# Altium schematic sheet vaSmd-V3.SchDoc
size A4; PageSetup: Record=PageOptions|CenterHorizontal=True|CenterVertical=True|PrintScale=1.00|XCorrection=1.00|YCorrection=1.00|PrintKind=1|BorderSize=5000000|LeftOffset=0|BottomOffset=0|Orientation=2|PaperLength=1000|PaperWidth=1000|Scale=100|PaperSource=7|PrintQuality=-4|MediaType=1|DitherType=10|PaperKind=A4|PrintScaleMode=1
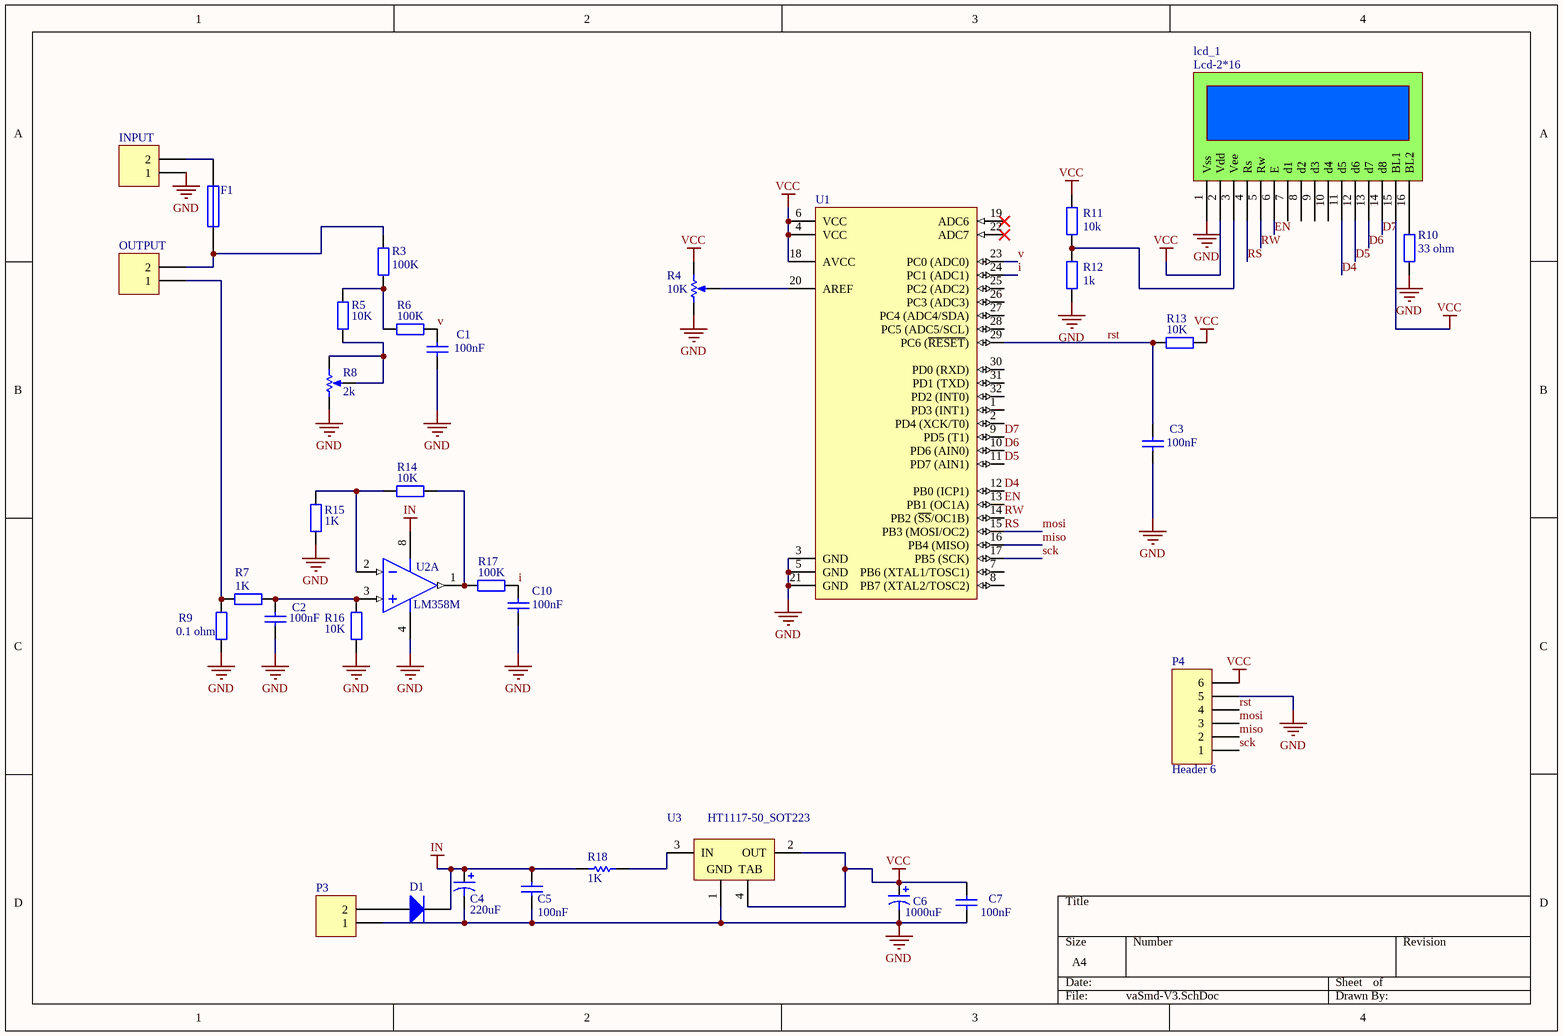
[diagram p0: vaSmd-V3.SchDoc]

## Parts
C1  value 100nF  [RESC3216m]
C2  value 100nF  [RESC3216m]
C3  value 100nF  [RESC3216m]
C4  value 220uF  [cap_smd_10*10.5]
C5  value 100nF  [RESC3216m]
C6  value 1000uF  [cap_smd_10*10.5]
C7  value 100nF  [RESC3216m]
C10  value 100nF  [RESC3216m]
D1  (no value)  [DO-35]
F1  (no value)  [fuse1]
INPUT  (no value)  [terminal_2pin]
lcd_1  (no value)  [HDR1X16]
OUTPUT  (no value)  [terminal_2pin]
P3  (no value)  [Mokhaberati_2pin]
P4  Header 6  [Mokhaberati_6pin]
R3  value 100K  [RESC3216m]
R4  value 10K  [VR5]
R5  value 10K  [RESC3216m]
R6  value 100K  [RESC3216m]
R7  value 1K  [RESC3216m]
R8  value 2k  [VR5]
R9  value 0.1 ohm  [AXIAL-0.9]
R10  value 33 ohm  [RESC3216m]
R11  value 10k  [RESC3216m]
R12  value 1k  [RESC3216m]
R13  value 10K  [RESC3216m]
R14  value 10K  [RESC3216m]
R15  value 1K  [RESC3216m]
R16  value 10K  [RESC3216m]
R17  value 100K  [RESC3216m]
R18  value 1K  [AXIAL-0.4]  (hidden comment: Res1)
U1  (no value)  [32A_N]
U2  LM358M  [M08A_N]  (part A of 2)
U3  HT1117-50_SOT223  [SOT223_N]

## Nets
GND: C1.1 C2.1 C3.1 C4.2 C5.1 C6.2 C7.1 C10.1 INPUT.1 lcd_1.1(Vss) P3.1 P4.5 R4.1(TOP) R8.1(TOP) R9.1 R10.1 R12.1 R15.1 R16.1 U1.3(GND) U1.5(GND) U1.21(GND) U2.4(GND) U3.1(GND)
IN: C4.1 C5.2 D1.2(K) R18.2 U2.8(V+)
VCC: C6.1 C7.2 lcd_1.2(Vdd) lcd_1.15(BL1) P4.6 R4.2(BOT) R11.2 R13.2 U1.4(VCC) U1.6(VCC) U1.18(AVCC) U3.2(OUT) U3.4(TAB)
D4: lcd_1.11(d5) U1.12(PB0_(ICP1))
D5: lcd_1.12(d6) U1.11(PD7_(AIN1))
D6: lcd_1.13(d7) U1.10(PD6_(AIN0))
D7: lcd_1.14(d8) U1.9(PD5_(T1))
EN: lcd_1.6(E) U1.13(PB1_(OC1A))
i: C10.2 R17.2 U1.24(PC1_(ADC1))
miso: P4.2 U1.16(PB4_(MISO))
mosi: lcd_1.4(Rs) P4.3 U1.15(PB3_(MOSI/OC2))  [also labelled RS]
rst: C3.2 P4.4 R13.1 U1.29(PC6_(~{RESET}))
RW: lcd_1.5(Rw) U1.14(PB2_(~{SS}/OC1B))
sck: P4.1 U1.17(PB5_(SCK))
v: C1.2 R6.2 U1.23(PC0_(ADC0))
NetC2_2: C2.2 R7.2 R16.2 U2.3(INA+)
NetD1_1: D1.1(A) P3.2
NetF1_1: F1.1 INPUT.2
NetF1_2: F1.2 OUTPUT.2 R3.2
Netlcd_1_3: lcd_1.3(Vee) R11.1 R12.2
Netlcd_1_16: lcd_1.16(BL2) R10.2
NetOUTPUT_1: OUTPUT.1 R7.1 R9.2
NetR3_1: R3.1 R5.2 R6.1
NetR4_3: R4.3(TAP) U1.20(AREF)
NetR5_1: R5.1 R8.2(BOT) R8.3(TAP)
NetR14_1: R14.1 R15.2 U2.2(INA-)
NetR14_2: R14.2 R17.1 U2.1(OUTA)
NetR18_1: R18.1 U3.3(IN)

Not connected (* = marked no-connect by the designer): lcd_1 7(d1) 8(d2) 9(d3) 10(d4); U1 1(PD3_(INT1)) 2(PD4_(XCK/T0)) 7(PB6_(XTAL1/TOSC1)) 8(PB7_(XTAL2/TOSC2)) 19(ADC6)* 22(ADC7)* 25(PC2_(ADC2)) 26(PC3_(ADC3)) 27(PC4_(ADC4/SDA)) 28(PC5_(ADC5/SCL)) 30(PD0_(RXD)) 31(PD1_(TXD)) 32(PD2_(INT0))

## Notes on the sheet
- (in symbol lcd-2*16) Lcd-2*16

## Library data of the parts
C1-C3 C5 C7 C10 = Cap: Capacitor; Published: 8-Jun-2000; LatestRevisionDate: 17-Jul-2002; LatestRevisionNote: Re-released for DXP Platform.; PackageReference: RAD-0.3; Publisher: Altium Limited
C4 C6 = Cap Pol1: Polarized Capacitor (Radial); Published: 8-Jun-2000; LatestRevisionDate: 17-Jul-2002; LatestRevisionNote: Re-released for DXP Platform.; PackageReference: RB7.6-15; Publisher: Altium Limited
D1 = Diode 1N4148: High Conductance Fast Diode; Published: 8-Jun-2000; LatestRevisionDate: 17-Jul-2002; LatestRevisionNote: Re-released for DXP Platform.; DatasheetVersion: 1997; PackageReference: DO-35; Publisher: Altium Limited; PackageDescription: Diode, Axial; Body 3.8 x 1.9 mm (LxDia. max), Lead Dia. 0.53 mm (max); Code_JEDEC: DO-204-AH; ComponentLink1Description: Manufacturer Link; ComponentLink1URL: http://www.fairchildsemi.com/; ComponentLink2Description: Datasheet; ComponentLink2URL: http://www.fairchildsemi.com/ds/1N%2F1N4148.pdf
F1 = Fuse 1: Fuse; Published: 8-Jun-2000; LatestRevisionDate: 17-Jul-2002; LatestRevisionNote: Re-released for DXP Platform.; PackageReference: PIN-W2/E2.8; Publisher: Altium Limited
INPUT OUTPUT P3 = Header 2: Header, 2-Pin; LatestRevisionDate: 17-Jul-2002; LatestRevisionNote: Re-released for DXP Platform.; Publisher: Altium Limited
lcd_1 = lcd-2*16
P4 = Header 6: Header, 6-Pin; LatestRevisionDate: 17-Jul-2002; LatestRevisionNote: Re-released for DXP Platform.; Publisher: Altium Limited
R3 R5-R7 R9-R17 = Res2: Resistor; Published: 8-Jun-2000; LatestRevisionDate: 17-Jul-2002; LatestRevisionNote: Re-released for DXP Platform.; PackageReference: AXIAL-0.4; Publisher: Altium Limited
R4 = RPot: Potentiometer; pin to pad: 2>3 3>2; Sim Note: Enter the Resistance value and the set point into parameter fields.; Set Position: 0.5; Published: 8-Jun-2000; LatestRevisionDate: 17-Jul-2002; LatestRevisionNote: Re-released for DXP Platform.; PackageReference: VR5; Publisher: Altium Limited
R8 = RPot: Potentiometer; Sim Note: Enter the Resistance value and the set point into parameter fields.; Set Position: 0.5; Published: 8-Jun-2000; LatestRevisionDate: 17-Jul-2002; LatestRevisionNote: Re-released for DXP Platform.; PackageReference: VR5; Publisher: Altium Limited
R18 = Res1: Resistor; Published: 8-Jun-2000; LatestRevisionDate: 17-Jul-2002; LatestRevisionNote: Re-released for DXP Platform.; PackageReference: AXIAL-0.3; Publisher: Altium Limited; PackageDescription: Axial Device, Thru-Hole; 2 Leads; 0.3 in Pin Spacing
U1 = ATmega8A-AU: 8-bit AVR Microcontroller, 8KB Flash, 512 Bytes EEPROM, 1KB SRAM, 32-pin TQFP, Industrial Grade (-40°C to 85°C); Published: 1-Apr-2010; DatasheetVersion: revC, Jul-2009; PackageVersion: revB, Oct-2001; PackageReference: 32A; Publisher: Altium Limited; PackageDescription: 32-Lead, 7x7x1.0 mm Body, 0.8mm Lead Pitch, Thin Profile Plastic Quad Flat Package (TQFP); Supplier 1: Digi-Key; Supplier Part Number 1: ATMEGA8A-AU-ND; Supplier 2: Farnell; Supplier Part Number 2: 1748532; Supplier 3: Mouser; Supplier Part Number 3: 556-ATMEGA8A-AU; Code_JEDEC: MS-026-ABA; ComponentLink1Description: Manufacturer Link; ComponentLink1URL: http://www.atmel.com/products/avr/default.asp?; ComponentLink2Description: ATmega8A Datasheet; ComponentLink2URL: http://www.atmel.com/dyn/resources/prod_documents/doc8159.pdf; ComponentLink3Description: ATmega8A Summary; ComponentLink3URL: http://www.atmel.com/dyn/resources/prod_documents/8159S.pdf; ComponentLink4Description: Atmel.com Home; ComponentLink4URL: http://www.atmel.com
U2 = LM358M: Low Power Dual Operational Amplifier, 8-pin Narrow SOIC; Manufacturer: National Semiconductor; PackageTopMarking: NSZXTT*LM*358M; PowerWise: N; CompType: Amplifiers; High-Reliability: Y; DatasheetVersion: Oct-2005; PackageVersion: revM, May-2009; PackageReference: M08A; PackageDescription: SOIC Narrow, 4.9 x 3.9 x 1.45mm, 8 Lead, 1.27mm Pitch; PartNumber: LM358M; RoHS: N; PinCount: 8; Code_JEDEC: MS-012-AA; Code_IPC: SOIC127P600-8; ComponentLink1Description: Manufacturer URL; ComponentLink1URL: http://www.national.com/; ComponentLink2Description: LM358 Datasheet; ComponentLink2URL: http://www.national.com/ds/LM/LM358.pdf; ComponentLink3Description: LM358 Web Page; ComponentLink3URL: http://www.national.com/pf/LM/LM358.html; ComponentLink4Description: M08A Package Page; ComponentLink4URL: http://www.national.com/packaging/folders/m08a.html
U3 = HT1117-50_SOT223: 5.0V, 1A General Purpose LDO; DatasheetVersion: rev1.10, Mar-2008; PackageVersion: 25/05/2010; PackageReference: SOT223; PackageDescription: 4-Pin SOT-223 Package, 6.5 x 3.5 mm Body, 2.3 mm Pitch, 7 mm Lead Span; ComponentLink1Description: Manufacturer URL; ComponentLink1URL: http://www.holtek.com/; ComponentLink2Description: Datasheet; ComponentLink2URL: http://www.holtek.com/pdf/consumer/1117v110.pdf; ComponentLink3Description: Package Specification; ComponentLink3URL: http://www.holtek.com/english/literature/package.pdf